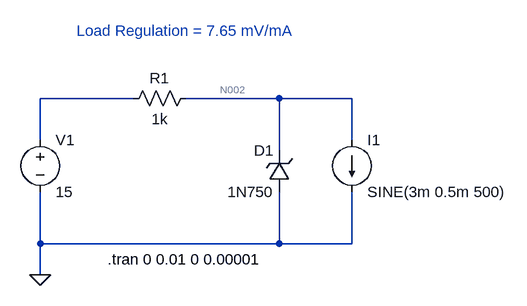
[diagram p0: schematic Problem03.asc]
Problem03.asc, the LTspice schematic file:
Version 4
SHEET 1 880 680
WIRE 112 64 -32 64
WIRE 336 64 192 64
WIRE 448 64 336 64
WIRE -32 128 -32 64
WIRE 448 128 448 64
WIRE 336 144 336 64
WIRE -32 288 -32 208
WIRE 336 288 336 208
WIRE 336 288 -32 288
WIRE 448 288 448 208
WIRE 448 288 336 288
WIRE -32 336 -32 288
FLAG -32 336 0
SYMBOL voltage -32 112 R0
WINDOW 123 0 0 Left 0
WINDOW 39 0 0 Left 0
SYMATTR InstName V1
SYMATTR Value 15
SYMBOL res 208 48 R90
WINDOW 0 0 56 VBottom 2
WINDOW 3 32 56 VTop 2
SYMATTR InstName R1
SYMATTR Value 1k
SYMBOL zener 352 208 R180
WINDOW 0 24 64 Left 2
WINDOW 3 24 0 Left 2
SYMATTR InstName D1
SYMATTR Value 1N750
SYMBOL current 448 128 R0
WINDOW 123 0 0 Left 0
WINDOW 39 0 0 Left 0
SYMATTR InstName I1
SYMATTR Value SINE(3m 0.5m 500)
TEXT 72 312 Left 2 !.tran 0 0.01 0 0.00001
TEXT 24 -40 Left 2 ;Load Regulation = 7.65 mV/mA

The netlist it stands for:
* Problem03.asc
V1 N001 0 15
R1 N002 N001 1k
D1 0 N002 1N750
I1 N002 0 SINE(3m 0.5m 500)
.model D D
.lib standard.dio
.tran 0 0.01 0 0.00001
* Load Regulation = 7.65 mV/mA
.backanno
.end

* Results of the author's LTspice run, read from the files saved beside the schematic
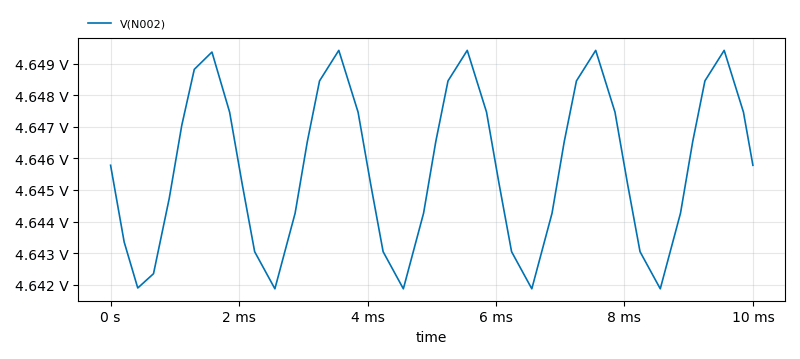
[diagram p1: Transient Analysis of Problem03.asc, plotted from the saved traces]
* Transient Analysis, 1 run:
*   V(N002): min 4.642 V, max 4.649 V, average 4.646 V, rms 4.646 V, last 4.646 V